# Altium schematic sheet PB_ExtenderPlug.SchDoc: PB Extender Board Socket
size A4; Revision: 5; SheetNumber: 4; SheetTotal: 7; Organization: Altium Limited.; Address1: Level 3, 12a Rodborough Rd; Address2: Frenchs Forest 2086; Address3: NSW; Address4: AUSTRALIA
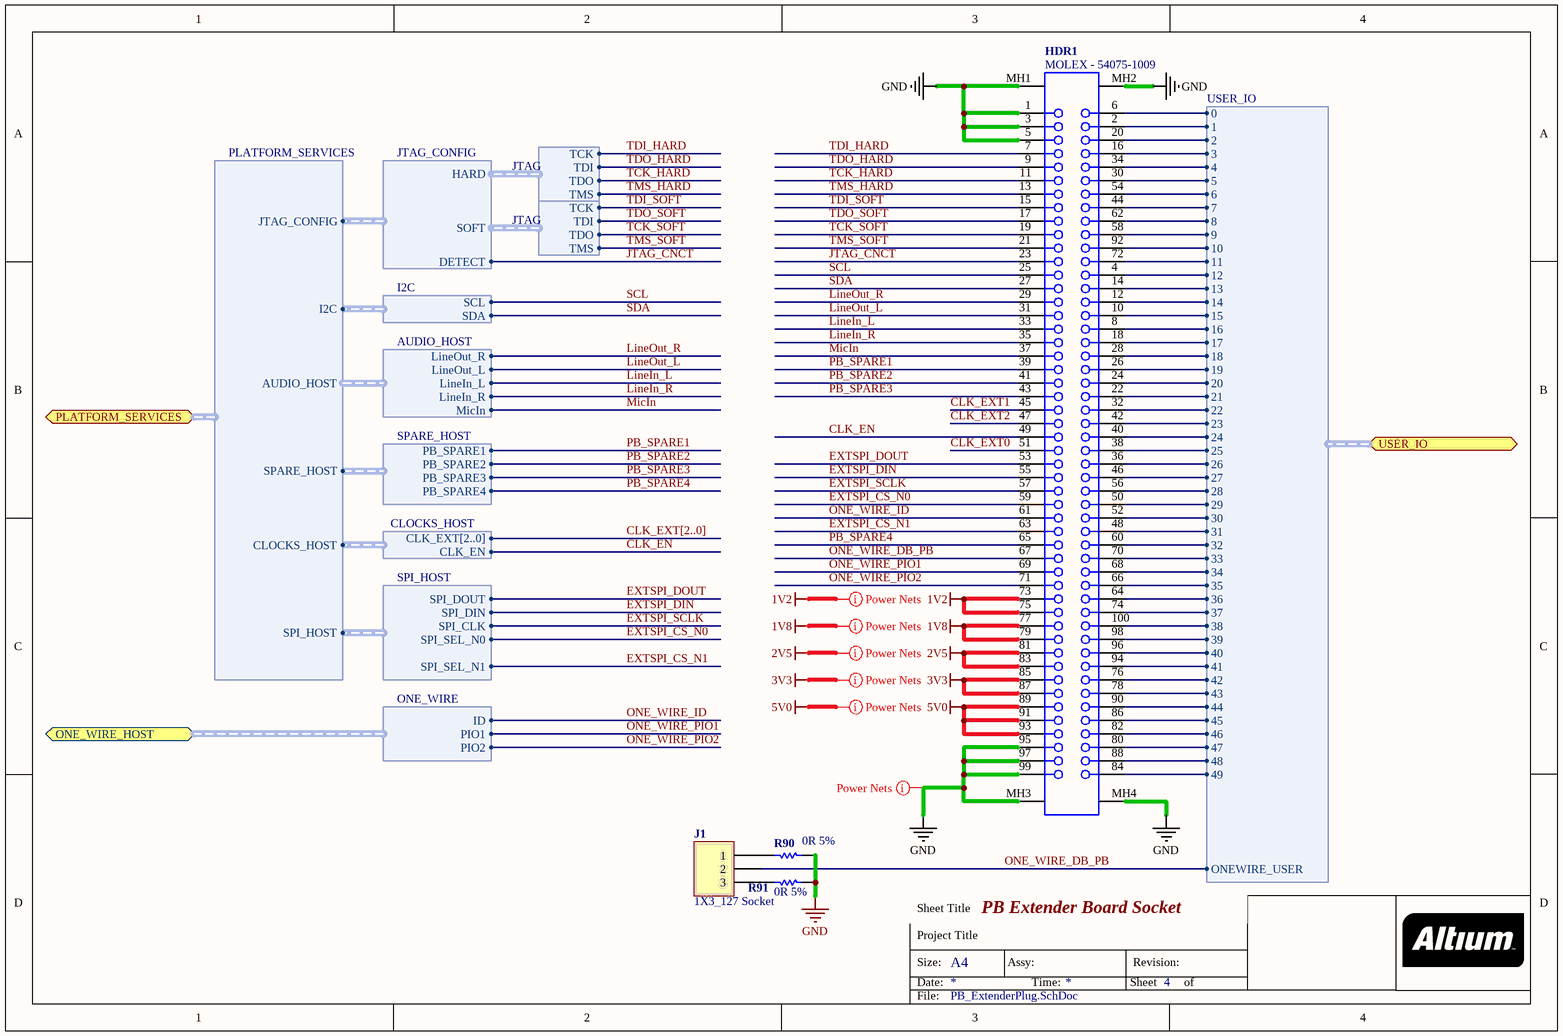
[diagram p0: PB_ExtenderPlug.SchDoc]

## Parts
HDR1  MOLEX - 54075-1009  [54075]
J1  1X3_127 Socket  [MHDR1X3_127]
R90  0R 5%  [RESC1005-STAR]
R91  0R 5%  [RESC1005-STAR]

## Ports
ONE_WIRE_HOST (harness ONE_WIRE), PLATFORM_SERVICES (harness PLATFORM_SERVICES), USER_IO (harness USER_IO)

## Harnesses
JTAG_CONFIG: HARD, SOFT, DETECT
JTAG: TCK, TDI, TDO, TMS
I2C: SCL, SDA
AUDIO_HOST: LineOut_R, LineOut_L, LineIn_L, LineIn_R, MicIn
SPARE_HOST: PB_SPARE1, PB_SPARE2, PB_SPARE3, PB_SPARE4
CLOCKS_HOST: CLK_EXT[2..0], CLK_EN
SPI_HOST: SPI_DOUT, SPI_DIN, SPI_CLK, SPI_SEL_N0, SPI_SEL_N1
USER_IO: 0, 1, 2, 3, 4, 5, 6, 7, 8, 9, 10, 11, 12, 13, 14, 15, 16, 17, 18, 19, 20, 21, 22, 23, 24, 25, 26, 27, 28, 29, 30, 31, 32, 33, 34, 35, 36, 37, 38, 39, 40, 41, 42, 43, 44, 45, 46, 47, 48, 49, ONEWIRE_USER
PLATFORM_SERVICES: JTAG_CONFIG, I2C, AUDIO_HOST, SPARE_HOST, CLOCKS_HOST, SPI_HOST
ONE_WIRE: ID, PIO1, PIO2

## Nets
1V2: HDR1.73 HDR1.75
1V8: HDR1.77 HDR1.79
2V5: HDR1.81 HDR1.83
3V3: HDR1.85 HDR1.87
5V0: HDR1.89 HDR1.91 HDR1.93
GND: HDR1.1 HDR1.3 HDR1.5 HDR1.95 HDR1.97 HDR1.99 HDR1.MH1 HDR1.MH2 HDR1.MH3 HDR1.MH4 R90.2 R91.2
CLK_EN: HDR1.49 ; harness CLOCKS_HOST.CLK_EN
CLK_EXT0: HDR1.51
CLK_EXT1: HDR1.45
CLK_EXT2: HDR1.47
EXTSPI_CS_N0: HDR1.59 ; harness SPI_HOST.SPI_SEL_N0
EXTSPI_CS_N1: HDR1.63 ; harness SPI_HOST.SPI_SEL_N1
EXTSPI_DIN: HDR1.55 ; harness SPI_HOST.SPI_DIN
EXTSPI_DOUT: HDR1.53 ; harness SPI_HOST.SPI_DOUT
EXTSPI_SCLK: HDR1.57 ; harness SPI_HOST.SPI_CLK
JTAG_CNCT: HDR1.23 ; harness JTAG_CONFIG.DETECT
LineIn_L: HDR1.33 ; harness AUDIO_HOST.LineIn_L
LineIn_R: HDR1.35 ; harness AUDIO_HOST.LineIn_R
LineOut_L: HDR1.31 ; harness AUDIO_HOST.LineOut_L
LineOut_R: HDR1.29 ; harness AUDIO_HOST.LineOut_R
MicIn: HDR1.37 ; harness AUDIO_HOST.MicIn
ONE_WIRE_DB_PB: HDR1.67 J1.2 ; port USER_IO.ONEWIRE_USER
ONE_WIRE_ID: HDR1.61 ; port ONE_WIRE_HOST.ID
ONE_WIRE_PIO1: HDR1.69 ; port ONE_WIRE_HOST.PIO1
ONE_WIRE_PIO2: HDR1.71 ; port ONE_WIRE_HOST.PIO2
PB_SPARE1: HDR1.39 ; harness SPARE_HOST.PB_SPARE1
PB_SPARE2: HDR1.41 ; harness SPARE_HOST.PB_SPARE2
PB_SPARE3: HDR1.43 ; harness SPARE_HOST.PB_SPARE3
PB_SPARE4: HDR1.65 ; harness SPARE_HOST.PB_SPARE4
SCL: HDR1.25 ; harness I2C.SCL
SDA: HDR1.27 ; harness I2C.SDA
TCK_HARD: HDR1.11 ; harness JTAG.TDO
TCK_SOFT: HDR1.19 ; harness JTAG.TDO
TDI_HARD: HDR1.7 ; harness JTAG.TCK
TDI_SOFT: HDR1.15 ; harness JTAG.TCK
TDO_HARD: HDR1.9 ; harness JTAG.TDI
TDO_SOFT: HDR1.17 ; harness JTAG.TDI
TMS_HARD: HDR1.13 ; harness JTAG.TMS
TMS_SOFT: HDR1.21 ; harness JTAG.TMS
NetHDR1_2: HDR1.2 ; port USER_IO.1
NetHDR1_4: HDR1.4 ; port USER_IO.12
NetHDR1_6: HDR1.6 ; port USER_IO.0
NetHDR1_8: HDR1.8 ; port USER_IO.16
NetHDR1_10: HDR1.10 ; port USER_IO.15
NetHDR1_12: HDR1.12 ; port USER_IO.14
NetHDR1_14: HDR1.14 ; port USER_IO.13
NetHDR1_16: HDR1.16 ; port USER_IO.3
NetHDR1_18: HDR1.18 ; port USER_IO.17
NetHDR1_20: HDR1.20 ; port USER_IO.2
NetHDR1_22: HDR1.22 ; port USER_IO.21
NetHDR1_24: HDR1.24 ; port USER_IO.20
NetHDR1_26: HDR1.26 ; port USER_IO.19
NetHDR1_28: HDR1.28 ; port USER_IO.18
NetHDR1_30: HDR1.30 ; port USER_IO.5
NetHDR1_32: HDR1.32 ; port USER_IO.22
NetHDR1_34: HDR1.34 ; port USER_IO.4
NetHDR1_36: HDR1.36 ; port USER_IO.26
NetHDR1_38: HDR1.38 ; port USER_IO.25
NetHDR1_40: HDR1.40 ; port USER_IO.24
NetHDR1_42: HDR1.42 ; port USER_IO.23
NetHDR1_44: HDR1.44 ; port USER_IO.7
NetHDR1_46: HDR1.46 ; port USER_IO.27
NetHDR1_48: HDR1.48 ; port USER_IO.31
NetHDR1_50: HDR1.50 ; port USER_IO.29
NetHDR1_52: HDR1.52 ; port USER_IO.30
NetHDR1_54: HDR1.54 ; port USER_IO.6
NetHDR1_56: HDR1.56 ; port USER_IO.28
NetHDR1_58: HDR1.58 ; port USER_IO.9
NetHDR1_60: HDR1.60 ; port USER_IO.32
NetHDR1_62: HDR1.62 ; port USER_IO.8
NetHDR1_64: HDR1.64 ; port USER_IO.36
NetHDR1_66: HDR1.66 ; port USER_IO.35
NetHDR1_68: HDR1.68 ; port USER_IO.34
NetHDR1_70: HDR1.70 ; port USER_IO.33
NetHDR1_72: HDR1.72 ; port USER_IO.11
NetHDR1_74: HDR1.74 ; port USER_IO.37
NetHDR1_76: HDR1.76 ; port USER_IO.42
NetHDR1_78: HDR1.78 ; port USER_IO.43
NetHDR1_80: HDR1.80 ; port USER_IO.47
NetHDR1_82: HDR1.82 ; port USER_IO.46
NetHDR1_84: HDR1.84 ; port USER_IO.49
NetHDR1_86: HDR1.86 ; port USER_IO.45
NetHDR1_88: HDR1.88 ; port USER_IO.48
NetHDR1_90: HDR1.90 ; port USER_IO.44
NetHDR1_92: HDR1.92 ; port USER_IO.10
NetHDR1_94: HDR1.94 ; port USER_IO.41
NetHDR1_96: HDR1.96 ; port USER_IO.40
NetHDR1_98: HDR1.98 ; port USER_IO.39
NetHDR1_100: HDR1.100 ; port USER_IO.38
NetJ1_1: J1.1 R90.1
NetJ1_3: J1.3 R91.1

## Buses and harness runs
bus CLK_EXT[2..0]

## Layout directives
net class Power: 1V2, 1V8, 2V5, 3V3, 5V0, GND

## Notes on the sheet
- Sheet Title
- Project Title
- Size:
- Date:
- A4
- Assy:
- Time:
- Sheet
- Revision:
- of
- File:

## Library data of the parts
HDR1 = D-300-0025: Connector, Molex Docking Station 100 Pin Male 54075; Category: Connector; Connector type: MOLEX - 54075-1009; Status: Production
J1 = D-300-0052: 1X3 Pin Vert 1.27mm Socket; Connector type: Header; Max Current: mA; LatestRevisionDate: 17-Jul-2002; LatestRevisionNote: Re-released for DXP Platform.; Publisher: Altium Limited; Mounting Technology: Through-Hole; Status: Unreleased; Category: Connector
R90 R91 = D-100-0137: Resistor, 0R 5% 0402 (1005); Power Rating: 63 mW; Mounting Technology: Surface Mount; Resistance: 0 R; Status: Unreleased; Tolerance: 5 %; Category: Resistor